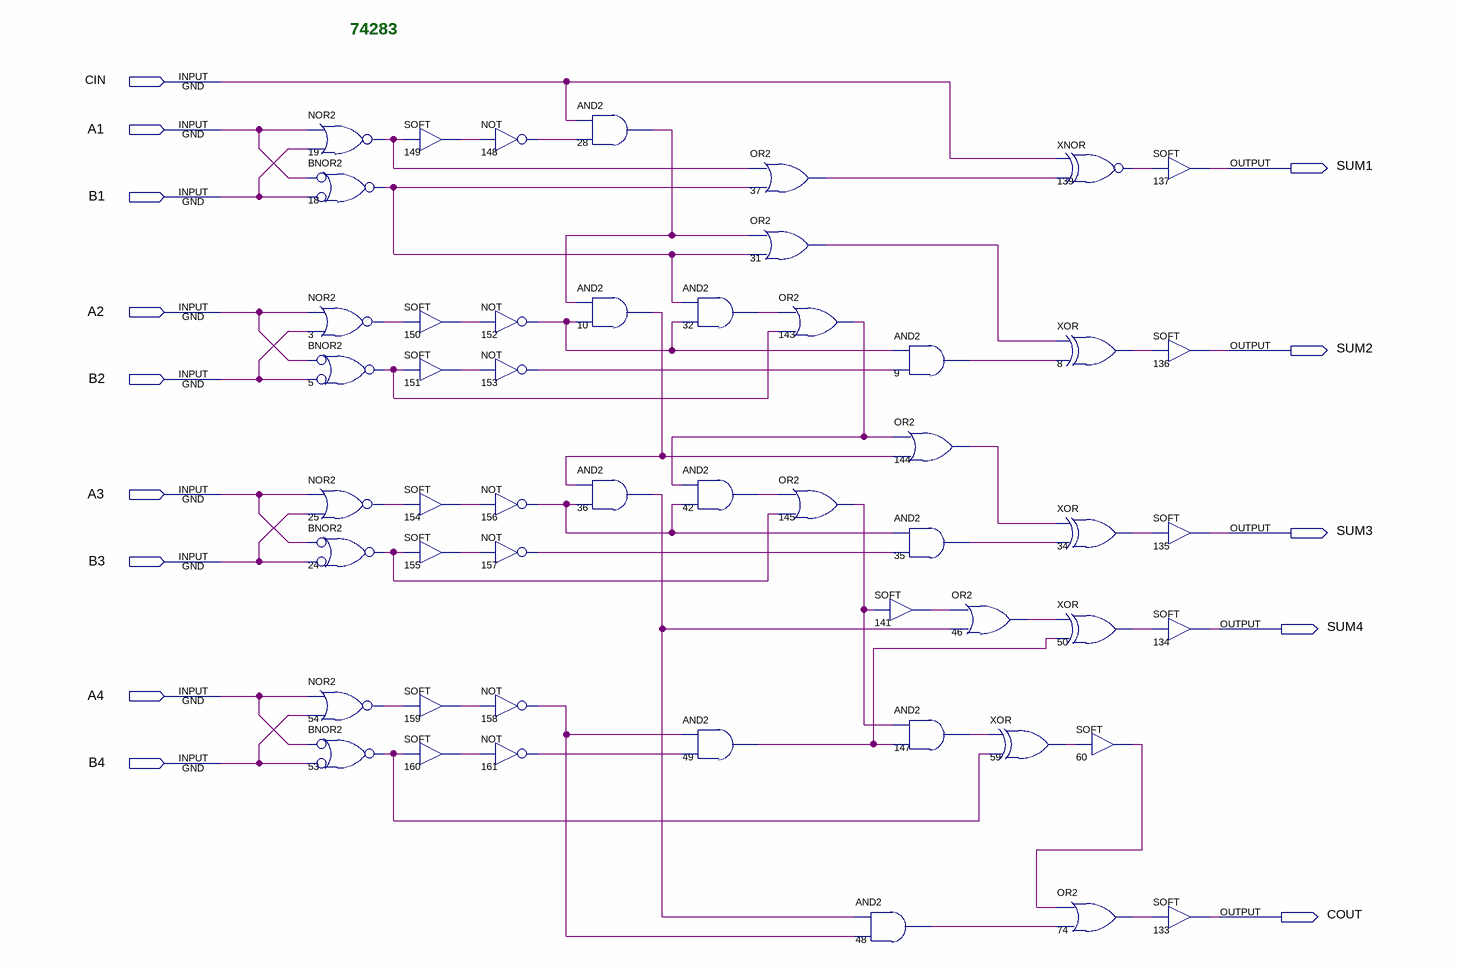
[diagram p0: schematic sheet]
// Quartus schematic p74283.bdf as structural Verilog: 51 symbols, 14 pins
module p74283 (
  input  CIN,
  input  A1,
  input  B1,
  input  A2,
  input  B2,
  input  A3,
  input  B3,
  input  A4,
  input  B4,
  output SUM1,
  output SUM2,
  output SUM3,
  output SUM4,
  output COUT
);

  wire n3_out, n5_out, n8_out, n9_out, n10_out, n18_out, n19_out, n24_out, n25_out, n28_out, n31_out,
       n32_out, n34_out, n35_out, n36_out, n37_out, n42_out, n46_out, n48_out, n49_out, n50_out, n53_out,
       n54_out, n59_out, n60_out, n74_out, n139_out, n141_out, n143_out, n144_out, n145_out, n147_out,
       n148_out, n149_out, n150_out, n151_out, n152_out, n153_out, n154_out, n155_out, n156_out, n157_out,
       n158_out, n159_out, n160_out, n161_out;

  nor u_19 (n19_out, A1, B1);
  nor u_18 (n18_out, ~A1, ~B1);  // BNOR2
  nor u_3 (n3_out, A2, B2);
  nor u_5 (n5_out, ~A2, ~B2);  // BNOR2
  nor u_25 (n25_out, A3, B3);
  nor u_24 (n24_out, ~A3, ~B3);  // BNOR2
  nor u_54 (n54_out, A4, B4);
  nor u_53 (n53_out, ~A4, ~B4);  // BNOR2
  SOFT u_149 (.IN(n19_out), .OUT(n149_out));
  SOFT u_150 (.IN(n3_out), .OUT(n150_out));
  SOFT u_151 (.IN(n5_out), .OUT(n151_out));
  SOFT u_154 (.IN(n25_out), .OUT(n154_out));
  SOFT u_155 (.IN(n24_out), .OUT(n155_out));
  SOFT u_159 (.IN(n54_out), .OUT(n159_out));
  SOFT u_160 (.IN(n53_out), .OUT(n160_out));
  not u_148 (n148_out, n149_out);
  not u_152 (n152_out, n150_out);
  not u_153 (n153_out, n151_out);
  not u_156 (n156_out, n154_out);
  not u_157 (n157_out, n155_out);
  not u_158 (n158_out, n159_out);
  not u_161 (n161_out, n160_out);
  and u_28 (n28_out, CIN, n148_out);
  and u_10 (n10_out, n28_out, n152_out);
  and u_36 (n36_out, n10_out, n156_out);
  and u_32 (n32_out, n18_out, n152_out);
  and u_42 (n42_out, n143_out, n156_out);
  and u_49 (n49_out, n158_out, n161_out);
  or u_37 (n37_out, n19_out, n18_out);
  or u_31 (n31_out, n28_out, n18_out);
  or u_143 (n143_out, n32_out, n5_out);
  or u_145 (n145_out, n42_out, n24_out);
  and u_9 (n9_out, n152_out, n153_out);
  or u_144 (n144_out, n143_out, n10_out);
  and u_35 (n35_out, n156_out, n157_out);
  SOFT u_141 (.IN(n145_out), .OUT(n141_out));
  and u_147 (n147_out, n145_out, n49_out);
  and u_48 (n48_out, n36_out, n158_out);
  or u_46 (n46_out, n141_out, n36_out);
  xor u_59 (n59_out, n147_out, n53_out);
  xnor u_139 (n139_out, CIN, n37_out);
  xor u_8 (n8_out, n31_out, n9_out);
  xor u_34 (n34_out, n144_out, n35_out);
  xor u_50 (n50_out, n46_out, n49_out);
  or u_74 (n74_out, n60_out, n48_out);
  SOFT u_60 (.IN(n59_out), .OUT(n60_out));
  SOFT u_137 (.IN(n139_out), .OUT(SUM1));
  SOFT u_136 (.IN(n8_out), .OUT(SUM2));
  SOFT u_135 (.IN(n34_out), .OUT(SUM3));
  SOFT u_134 (.IN(n50_out), .OUT(SUM4));
  SOFT u_133 (.IN(n74_out), .OUT(COUT));

  // Notes on the sheet:
  //   74283
endmodule
